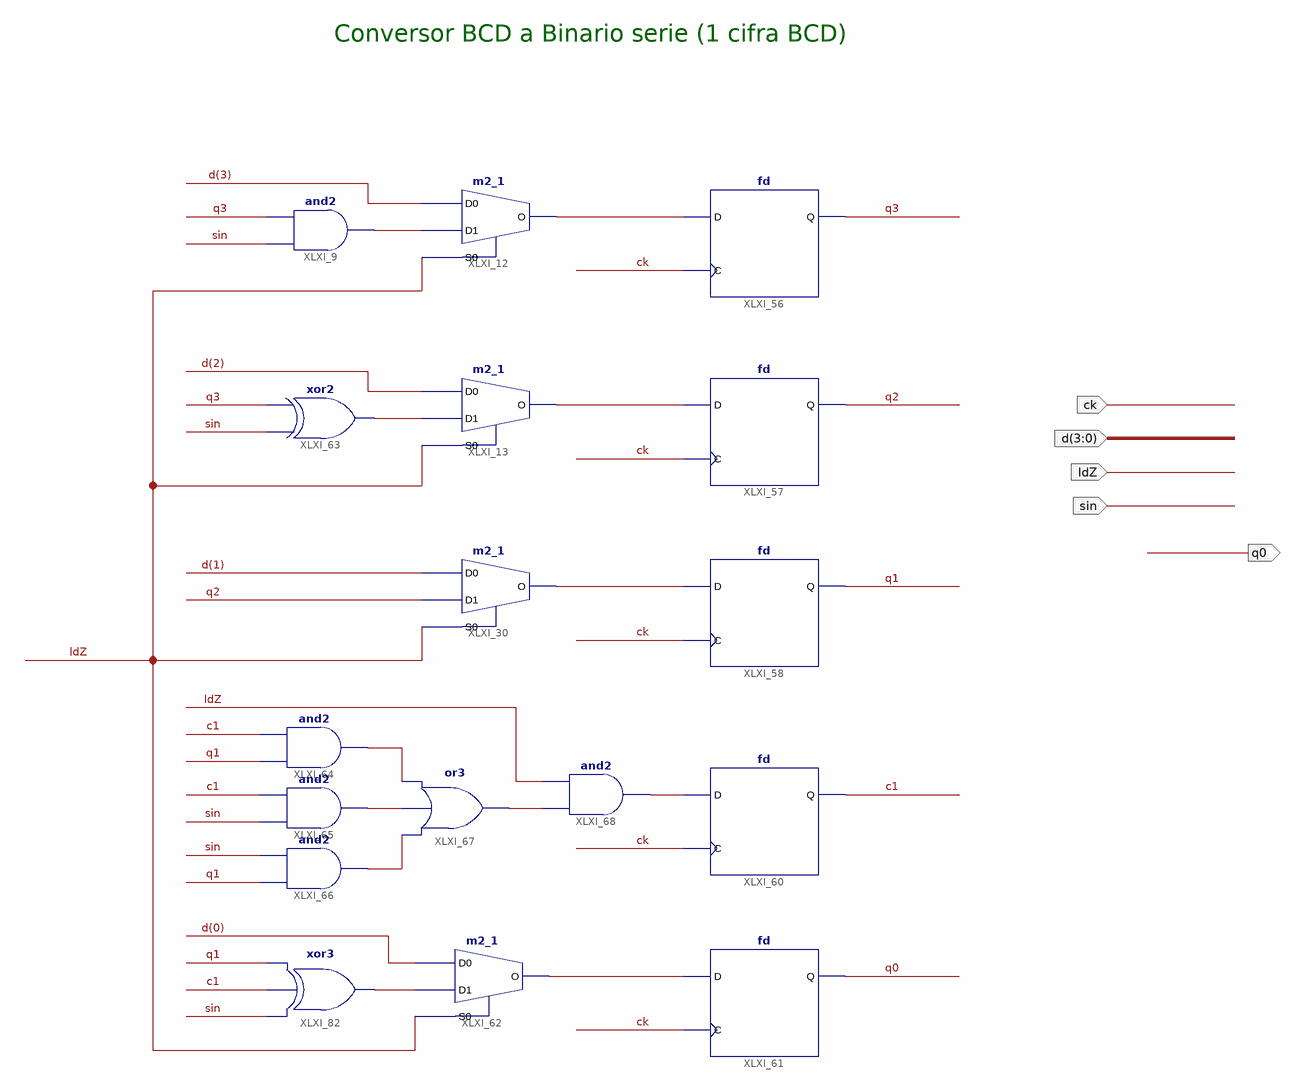
[diagram p0: schematic sheet 1]
// Xilinx ISE schematic BCD_A_Bin.sch (spartan6) as structural Verilog: 17 symbols, 5 ports
module BCD_A_Bin (
  input  ck,
  input  ldZ,
  input  sin,
  input  [3:0] d,
  output q0
);

  wire c1, q1, q2, q3, XLXN_6, XLXN_7, XLXN_8, XLXN_48, XLXN_49, XLXN_53, XLXN_58, XLXN_59, XLXN_60, XLXN_61,
       XLXN_62, XLXN_82;

  m2_1 XLXI_13 (.D0(d[2]), .D1(XLXN_49), .S0(ldZ), .O(XLXN_7));
  m2_1 XLXI_30 (.D0(d[1]), .D1(q2), .S0(ldZ), .O(XLXN_8));
  m2_1 XLXI_12 (.D0(d[3]), .D1(XLXN_48), .S0(ldZ), .O(XLXN_6));
  and XLXI_9 (XLXN_48, sin, q3);
  fd XLXI_56 (.C(ck), .D(XLXN_6), .Q(q3));
  fd XLXI_57 (.C(ck), .D(XLXN_7), .Q(q2));
  fd XLXI_58 (.C(ck), .D(XLXN_8), .Q(q1));
  xor XLXI_63 (XLXN_49, sin, q3);
  fd XLXI_60 (.C(ck), .D(XLXN_62), .Q(c1));
  fd XLXI_61 (.C(ck), .D(XLXN_53), .Q(q0));
  m2_1 XLXI_62 (.D0(d[0]), .D1(XLXN_82), .S0(ldZ), .O(XLXN_53));
  and XLXI_64 (XLXN_59, q1, c1);
  and XLXI_65 (XLXN_58, sin, c1);
  and XLXI_66 (XLXN_60, q1, sin);
  or XLXI_67 (XLXN_61, XLXN_60, XLXN_58, XLXN_59);
  and XLXI_68 (XLXN_62, XLXN_61, ldZ);
  xor XLXI_82 (XLXN_82, sin, c1, q1);

  // Notes on the sheet:
  //   Conversor BCD a Binario serie (1 cifra BCD)
endmodule
